# Altium schematic sheet JHDH-8412_powerbank.SchDoc: JH-7656V1_powerbank
size A4
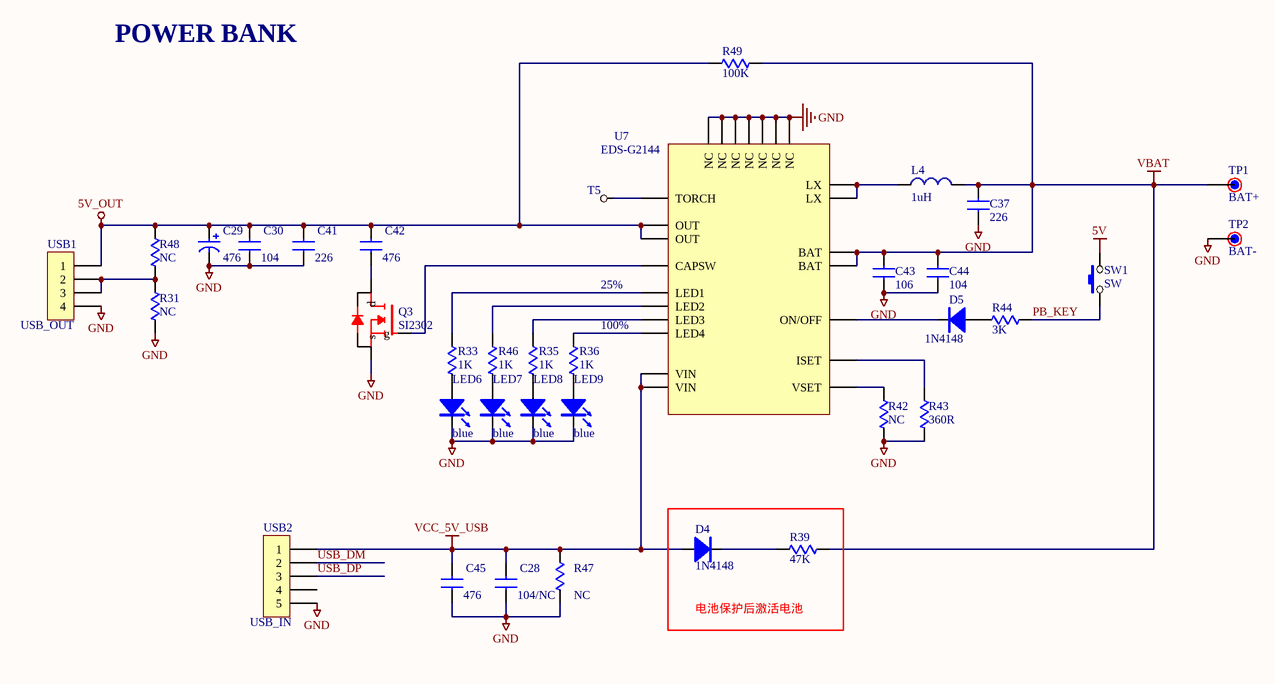
[diagram p0: JHDH-8412_powerbank.SchDoc]

## Parts
C28  104/NC  [C0402]
C29  476  [C1206]
C30  104  [C0402]
C37  226  [C0805]
C41  226  [C0805]
C42  476  [C0805]
C43  106  [C0805]
C44  104  [C0402]
C45  476  [C0805]
D4  1N4148  [D1206]
D5  1N4148  [D1206]
L4  1uH  [CD75]
LED6  blue  [LED0603B]
LED7  blue  [LED0603B]
LED8  blue  [LED0603B]
LED9  blue  [LED0603B]
Q3  SI2302  [SOT23]
R31  NC  [R0402]
R33  1K  [R0402]
R35  1K  [R0402]
R36  1K  [R0402]
R39  47K  [R0402]
R42  NC  [R0402]
R43  360R  [R0402]
R44  3K  [R0402]
R46  1K  [R0402]
R47  NC  [R0402]
R48  NC  [R0402]
R49  100K  [R0402]
SW1  SW  [KEY/IT-1201]
T5  (no value)  [PAD0]
TP1  BAT+  [PAD0]
TP2  BAT-  [PAD0]
U7  EDS-G2144  [TQFN24-4*4]
USB1  USB_OUT  [USB-A-SMT]
USB2  USB_IN  [USB-009]

## Blocks framed on the sheet
电池保护后激活电池: D4 R39

## Nets
5V: SW1.2
5V_OUT: C29.1 C30.1 C41.1 C42.1 R48.1 R49.1 U7.1(OUT) U7.2(OUT) USB1.1
GND: C28.2 C29.2 C30.2 C37.2 C41.2 C43.2 C44.2 C45.2 LED6.2(K) LED7.2(K) LED8.2(K) LED9.2(K) Q3.2(s) R31.2 R42.2 R43.2 R47.2 TP2.1 U7.10(NC) U7.19(NC) U7.20(NC) U7.21(NC) U7.22(NC) U7.23(NC) U7.24(NC) USB1.4 USB2.5
VBAT: C37.1 C43.1 C44.1 L4.2 R39.2 R49.2 TP1.1 U7.8(BAT) U7.11(BAT)
VCC_5V_USB: C28.1 C45.1 D4.1(A) R47.1 U7.6(VIN) U7.7(VIN) USB2.1
PB_KEY: R44.2 SW1.1
USB_DM: USB2.2
USB_DP: USB2.3
NetC42_2: C42.2 Q3.3(d)
NetD4_2: D4.2(K) R39.1
NetD5_1: D5.1(A) R44.1
NetD5_2: D5.2(K) U7.16(ON/OFF)
NetL4_1: L4.1 U7.17(LX) U7.18(LX)
NetLED6_1: LED6.1(A) R33.1
NetLED7_1: LED7.1(A) R46.1
NetLED8_1: LED8.1(A) R35.1
NetLED9_1: LED9.1(A) R36.1
NetQ3_1: Q3.1(g) U7.3(CAPSW)
NetR31_1: R31.1 R48.2 USB1.2 USB1.3
NetR33_2: R33.2 U7.4(LED1)
NetR35_2: R35.2 U7.14(LED3)
NetR36_2: R36.2 U7.13(LED4)
NetR42_1: R42.1 U7.9(VSET)
NetR43_1: R43.1 U7.15(ISET)
NetR46_2: R46.2 U7.5(LED2)
NetT5_1: T5.1(T) U7.12(TORCH)

Not connected (* = marked no-connect by the designer): USB2 4

## Notes on the sheet
- POWER BANK
- 25%
- 100%

## Library data of the parts
C28 C30 C37 C41-C45 = CAP: Capacitor; Value: *
C29 = CAP1: 电解电容
D4 D5 = 1N4148: 玻璃二极管
L4 = L-1: 电感
LED6 LED7 = LED-b: LED/蓝色
LED8 LED9 = LED-B: LED/蓝色
Q3 = MOSFETN: Mosfet/N; Value: *
R31 R33 R35 R36 R39 R42-R44 R46-R49 = RES: Resistor
  R31 R42-R44 R47-R49: Value: *
SW1 = SW: Tact Switch
T5 = CON1: Test
TP1 TP2 = TP
U7 = Component_1
USB1 = CON4: Connector
USB2 = CON5: Connector